# EAGLE schematic nokia3310 (EAGLE 6.4)
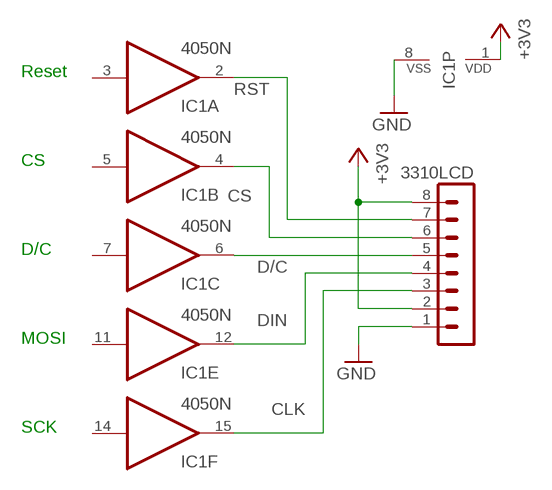
[diagram p0: schematic, sheet 1]

## Parts
3310LCD  MA08-1  [MA08-1]
IC1  4050N  [DIL16]

## Nets
+3V3: 3310LCD.2 3310LCD.8 IC1.1(P:VDD)
CLK: 3310LCD.3 IC1.15(F:O)
CS: 3310LCD.6 IC1.4(B:O)
D/C: 3310LCD.5 IC1.6(C:O)
DIN: 3310LCD.4 IC1.12(E:O)
GND: 3310LCD.1 IC1.8(P:VSS)
RST: 3310LCD.7 IC1.2(A:O)
Unconnected: IC1.3(A:I) IC1.5(B:I) IC1.7(C:I) IC1.9(D:I) IC1.10(D:O) IC1.11(E:I) IC1.14(F:I)

## Notes on the sheet
- Reset
- CS
- D/C
- MOSI
- SCK

## Library data of the parts
3310LCD = con-lstb:MA08-1: PIN HEADER; OC_FARNELL: unknown; OC_NEWARK: unknown
IC1 = 40xx:4050: Hex non-inverting BUFFER